# EAGLE design TrackLine_Schematic (EAGLE 7.3.0)
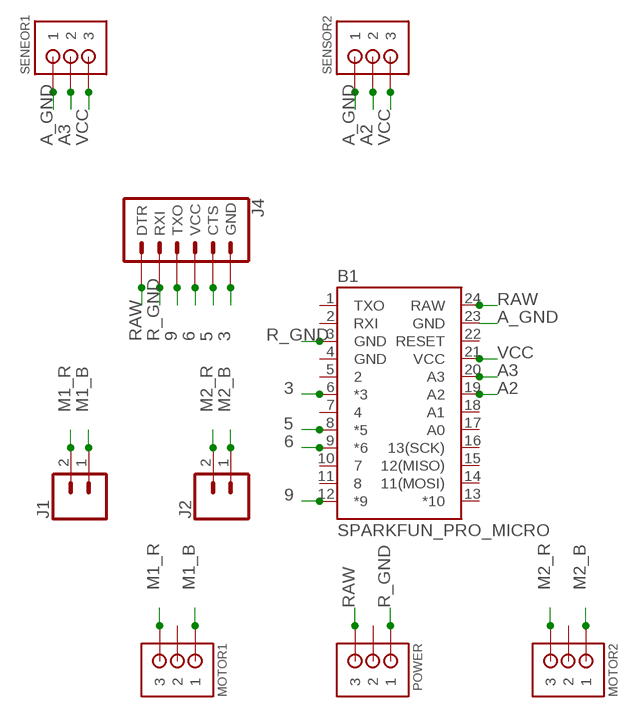
[diagram p0: schematic, sheet 1]

## Parts
B1  SPARKFUN_PRO_MICRO  [SPARKFUN_PRO_MICRO]
J1  CONN_025MM  [SCREWTERMINAL-5MM-2]
J2  CONN_025MM  [SCREWTERMINAL-5MM-2]
J4  6_PIN_SERIAL_TARGET  [1X06]
MOTOR1  JST-PH_3-PIN_HEADER  [JST_B3B-PH_HEADER]
MOTOR2  JST-PH_3-PIN_HEADER  [JST_B3B-PH_HEADER]
POWER  JST-PH_3-PIN_HEADER  [JST_B3B-PH_HEADER]
SENEOR1  JST-PH_3-PIN_HEADER  [JST_B3B-PH_HEADER]
SENSOR2  JST-PH_3-PIN_HEADER  [JST_B3B-PH_HEADER]

## Nets
3: B1.6(*3) J4.6(GND)
5: B1.8(*5) J4.5(CTS)
6: B1.9(*6) J4.4(VCC)
9: B1.12(*9) J4.3(TXO)
A2: B1.19(A2) SENSOR2.P2
A3: B1.20(A3) SENEOR1.P2
A_GND: B1.23(GND) SENEOR1.P1 SENSOR2.P1
M1_B: J1.1 MOTOR1.P1
M1_R: J1.2 MOTOR1.P3
M2_B: J2.1 MOTOR2.P1
M2_R: J2.2 MOTOR2.P3
R_GND: B1.3(GND) J4.2(RXI) POWER.P1
RAW: B1.24(RAW) J4.1(DTR) POWER.P3
VCC: B1.21(VCC) SENEOR1.P3 SENSOR2.P3
Unconnected: B1.1(TXO) B1.2(RXI) B1.5 B1.7 B1.10 B1.11 B1.13(*10) B1.14(11(MOSI)) B1.15(12(MISO)) B1.16(13(SCK)) B1.17(A0) B1.18(A1) B1.22(RESET) MOTOR1.P2 MOTOR2.P2 POWER.P2

## Power pins joined to a net without a drawn wire
GND: B1.4(GND)

## Library data of the parts
B1 = SparkFun-Boards:SPARKFUN_PRO_MICRO: SparkFun Pro Micro Atmega32U4 compatible footprint. SparkFun Products: 3.3V/8MHz <https://www.sparkfun.com/products/12587> 5V/16MHz <https://www.sparkfun.com/products/12640>
J1 J2 = SparkFun-Connectors:CONN_02: Multi connection point. Often used as Generic Header-pin footprint for 0.1 inch spaced/style header connections On any of the 0.1 inch spaced packages, you can populate with these: Break Away Headers - Straight <https://www.sparkfun.com/products/116> (PRT-00116) Break Away Male Headers - Right Angle <https://www.sparkfun.com/products/553> (PRT-00553) Female Headers <https://www.sparkfun.com/products/115> (PRT-00115) Break Away Headers - Machine Pin <https://www.sparkfun.com/products/117> (PRT-00117) Break Away Female Headers - Swiss Machine Pin <https://www.sparkfun.com/products/743> (PRT-00743) For SCREWTERMINALS and SPRING TERMINALS visit here: Screw Terimnals on SparkFun.com <https://www.sparkfun.com/search/results?term=Screw+Terminals> (5mm/3.5mm/2.54mm spacing) This device is also useful as a general connection point to wire up your design to another part of your project. Our various solder wires solder well into these plated through hole pads. Hook-Up Wire - Assortment (Stranded, 22 AWG) <https://www.sparkfun.com/products/11375> (PRT-11375) Hook-Up Wire - Assortment (Solid Core, 22 AWG) <https://www.sparkfun.com/products/11367> (PRT-11367) View the entire wire category on our website here <https://www.sparkfun.com/categories/141> Special notes: Molex polarized connector foot print use with: PRT-08233 with associated crimp pins and housings. 2.54_SCREWTERM for use with PRT-10571. 3.5mm Screw Terminal footprints for PRT-08084 5mm Screw Terminal footprints for use with PRT-08432; SF_SKU: PRT-08432
J4 = SparkFun-Connectors:6_PIN_SERIAL_TARGET: 6-pin header connection for use with the "FTDI BASIC" pinout - TARGET SIDE. Also known as "Arduino Serial Program Header". It is used to mate with our FTDI Basic serial programmers using the Arduino IDE. Note, this device has "TARGET" in the name. It is intended to be used on a design that contains a target micro-controller that you wish to program. The "sister" device, named "CABLE" is inteneded to be used on a design that usually lives on the end of your USB cable and prvides the converter chip (FTDI232 or FTDI231x) to commnicate serial RX/TX. You can populate with some of these: Break Away Headers - Straight <https://www.sparkfun.com/products/116> (PRT-00116) For reference (or to suit your programming needs) check out these designs: SparkFun FTDI Basic Breakout - 5V <https://www.sparkfun.com/products/9716> (DEV-09716) SparkFun FTDI Basic Breakout - 3.3V <https://www.sparkfun.com/products/9873> (DEV-09873) SparkFun FTDI SmartBasic <https://www.sparkfun.com/products/12935> (DEV-12935) SparkFun Beefy 3 - FTDI Basic Breakout <https://www.sparkfun.com/products/13746> (DEV-13746)
MOTOR1 MOTOR2 POWER SENEOR1 SENSOR2 = SRG:JST-PH_3-PIN_HEADER: 3-pin JST PH Shrouded Header, top entry P/N B3B-PH-K-S Mating connector PHR-3

## Board
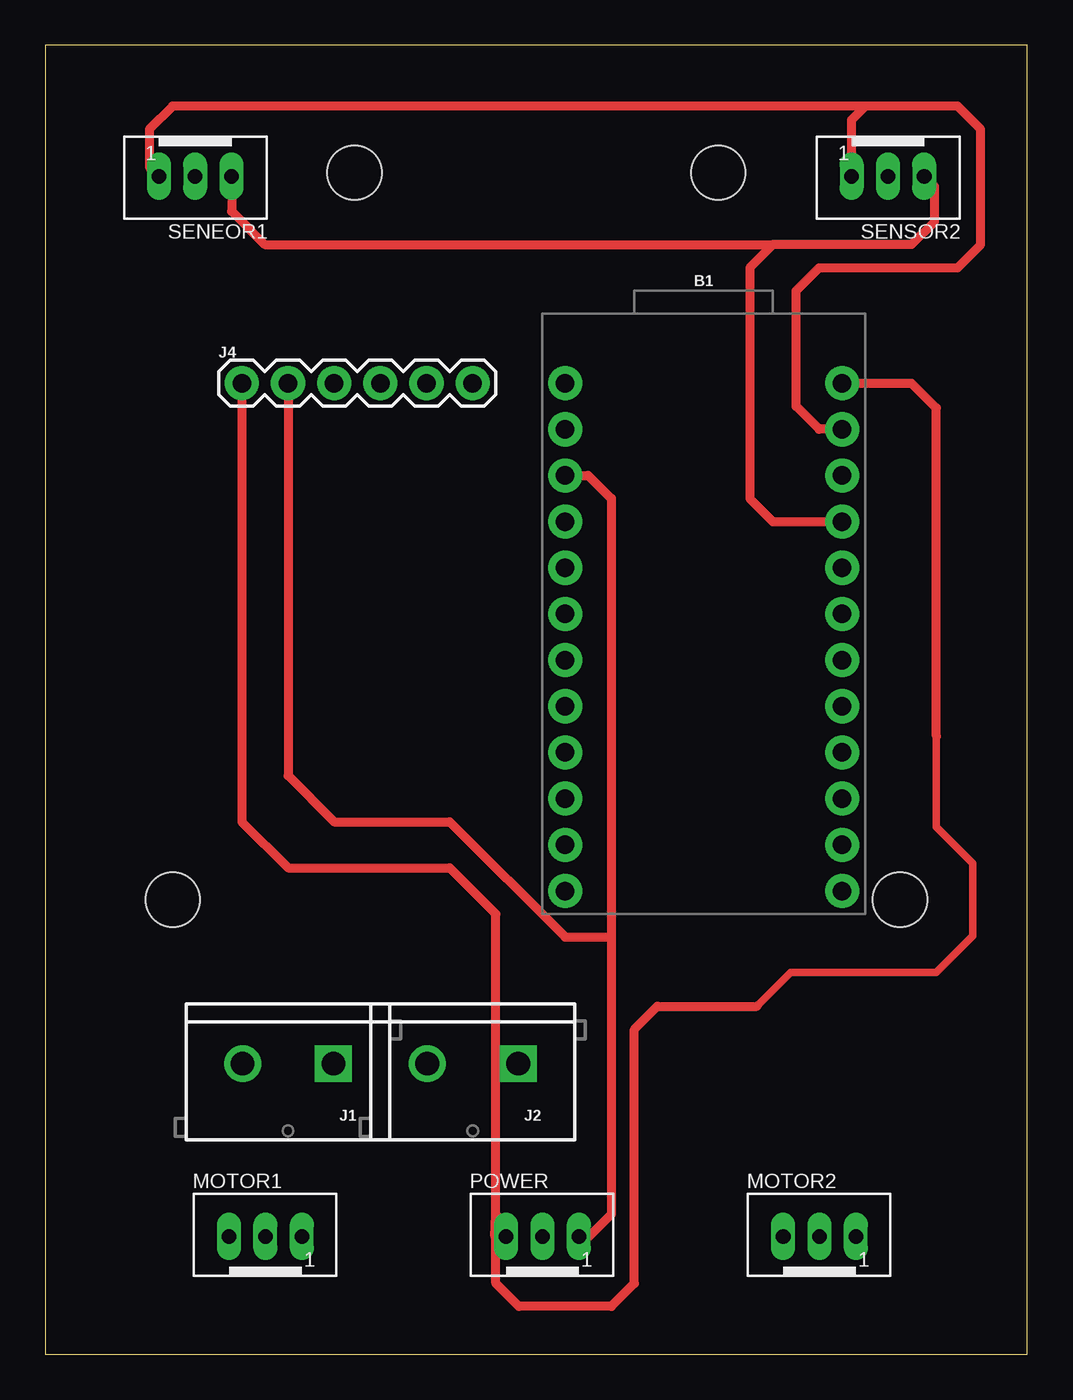
[diagram p1: board, top side]
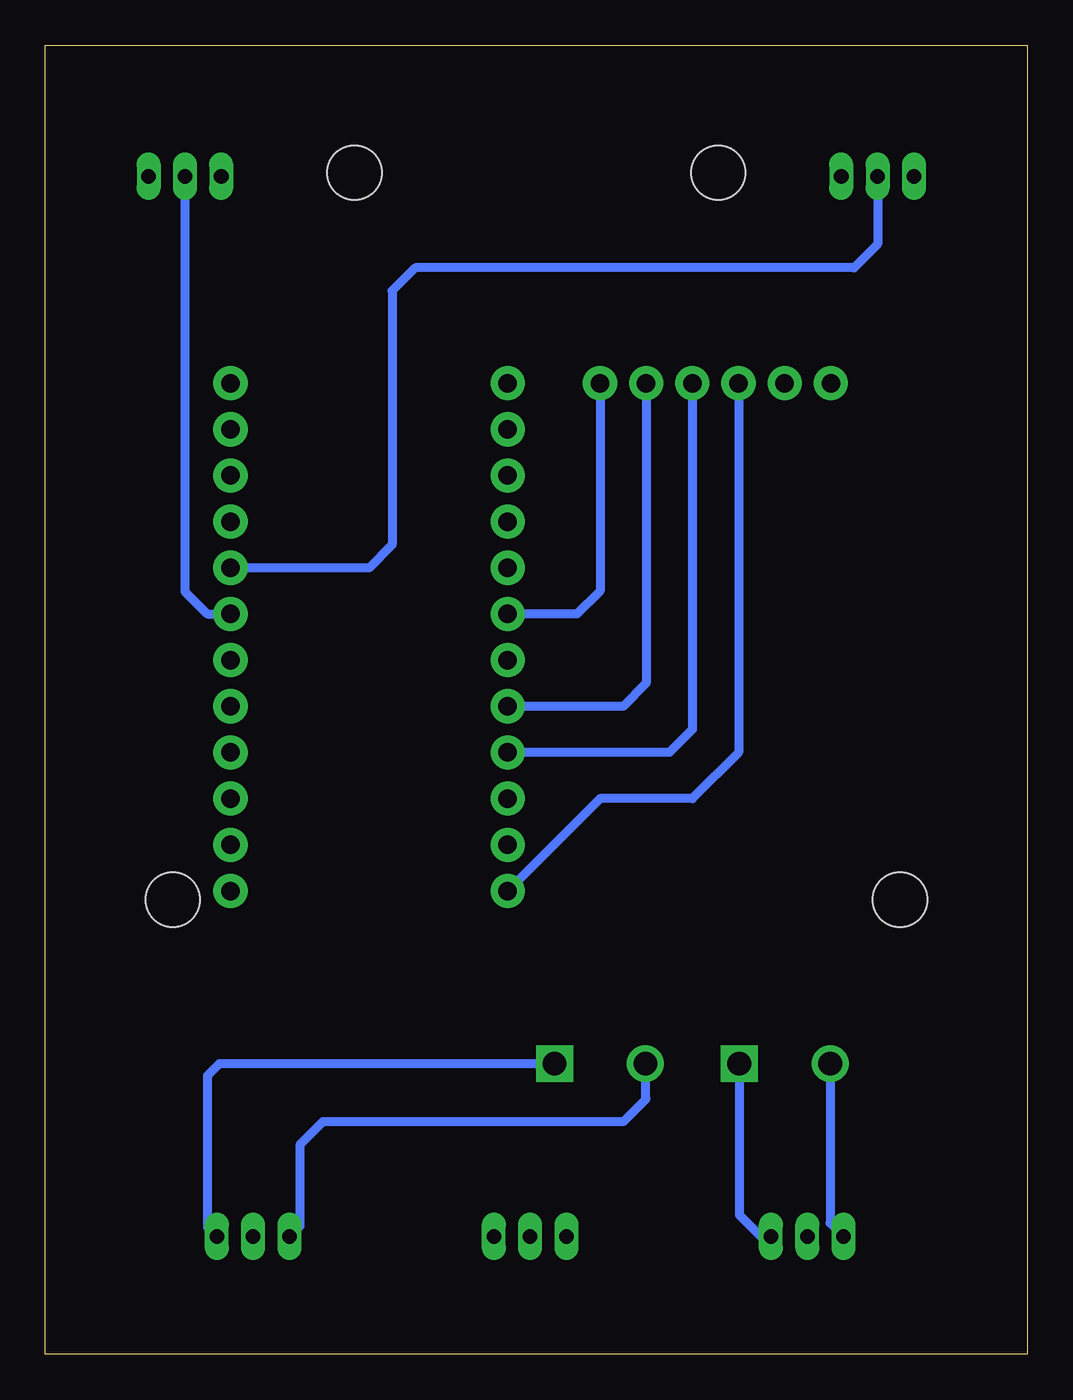
[diagram p2: board, bottom side, seen from below]

Size 54 x 72 mm. Coordinates in mm from the lower left corner, seen from the top.
Outline: 0,0 54,0 54,72 0,72 0,0
Copper layers (1*16): Top 0.035mm / dielectric 1.5mm / Bottom 0.035mm
Design rules "default": minimum track width 10mil, minimum drill 24mil, track to track 8mil, track to pad 8mil, pad to pad 8mil, via to via 8mil, smd to smd 8mil, copper to edge 40mil, drill to drill 8mil, minimum pad ring 10mil, minimum via ring 8mil, stop-mask expansion 4mil, vias tented up to drill 0mil, thermal gap 10mil
Holes 3 mm at 17,65 37,65 7,25 47,25

### Footprints (pad centres in the part's own frame; a part is rotated, then mirrored left to right if it is on the bottom)
SPARKFUN_PRO_MICRO = drill 1.016 pad 1.88: 1 -7.62,12.7; 2 -7.62,10.16; 3 -7.62,7.62; 4 -7.62,5.08; 5 -7.62,2.54; 6 -7.62,0; 7 -7.62,-2.54; 8 -7.62,-5.08; 9 -7.62,-7.62; 10 -7.62,-10.16; 11 -7.62,-12.7; 12 -7.62,-15.24; 13 7.62,-15.24; 14 7.62,-12.7; 15 7.62,-10.16; 16 7.62,-7.62; 17 7.62,-5.08; 18 7.62,-2.54; 19 7.62,0; 20 7.62,2.54; 21 7.62,5.08; 22 7.62,7.62; 23 7.62,10.16; 24 7.62,12.7
SCREWTERMINAL-5MM-2 = drill 1.3 pad 2.032 square: 1 0,0 | drill 1.3 pad 2.032: 2 5,0
1X06 = drill 1.016 pad 1.88: 1 0,0; 2 2.54,0; 3 5.08,0; 4 7.62,0; 5 10.16,0; 6 12.7,0
JST_B3B-PH_HEADER = drill 0.8 long: P1 2.027,0.048; P2 0.028,0.048; P3 -1.972,0.048

### Placement (x,y rotation side)
B1  36.2,40.72 0 top
J1  15.84,15.98 180 top
J2  26,15.98 180 top
J4  10.8,53.42 0 top
MOTOR1  12.07,6.43 0 top
MOTOR2  42.55,6.43 0 top
POWER  27.31,6.43 0 top
SENEOR1  8.26,64.85 180 top
SENSOR2  46.36,64.85 180 top

### Tracks (layer width: path | path; a pad name or v marks a point on that pad's centre or on a via)
3
  Bottom 0.5: J4.6 23.5,41.99 24.77,40.72 B1.6
5
  Bottom 0.5: J4.5 20.96,36.91 22.23,35.64 B1.8
6
  Bottom 0.5: J4.4 18.42,34.37 19.69,33.1 B1.9
9
  Bottom 0.5: J4.3 15.88,33.1 18.42,30.56 23.5,30.56 B1.12
A2
  Bottom 0.5: SENSOR2.P2 46.33,41.96 45.09,40.72 B1.19
A3
  Bottom 0.5: SENEOR1.P2 8.23,61.07 9.53,59.77 33.66,59.77 34.93,58.5 34.93,44.53 36.2,43.26 B1.20
A_GND
  Top 0.5: B1.23 42.55,50.88 41.28,52.15 41.28,58.5 42.55,59.77 50.17,59.77 51.44,61.04 51.44,67.39 50.17,68.66 45.09,68.66 | 45.09,68.66 6.99,68.66 5.72,67.39 5.72,65.31 SENEOR1.P1 | SENSOR2.P1 44.33,67.9 45.09,68.66
M1_B
  Bottom 0.5: J1.1 15.84,7.66 14.61,6.43 14.15,6.43 MOTOR1.P1
M1_R
  Bottom 0.5: J1.2 10.84,7.22 MOTOR1.P3
M2_B
  Bottom 0.5: J2.1 44.43,15.98 45.09,15.32 45.09,6.99 MOTOR2.P1
M2_R
  Bottom 0.5: J2.2 21,14.09 20.96,14.05 22.23,12.78 38.74,12.78 40.01,11.51 40.01,7.04 MOTOR2.P3
R_GND
  Top 0.5: B1.3 29.85,48.34 31.12,47.07 31.12,22.94 | 31.12,22.94 31.12,7.7 29.85,6.43 29.39,6.43 POWER.P1 | J4.2 13.34,31.83 15.88,29.29 22.23,29.29 28.58,22.94 31.12,22.94
RAW
  Top 0.406: 49,34 49,29 51,27 51,23 49,21 41,21 39.13,19.13
  Top 0.5: J4.1 10.8,29.29 13.34,26.75 22.23,26.75 24.77,24.21 24.77,7.7 24.72,6.48 24.77,6.43 | B1.24 47.63,53.42 49,52.05 49,34 | 24.77,6.43 24.77,3.89 26.04,2.62 31.12,2.62 32.39,3.89 32.39,17.86 33.66,19.13 39.13,19.13 | POWER.P3 24.82,6.48 24.77,6.43
VCC
  Top 0.5: SENEOR1.P3 10.23,62.88 12.07,61.04 40.01,61.04 | SENSOR2.P3 48.9,64.23 48.9,62.31 47.63,61.04 40.01,61.04 | 40.01,61.04 38.74,59.77 38.74,47.07 40.01,45.8 B1.21